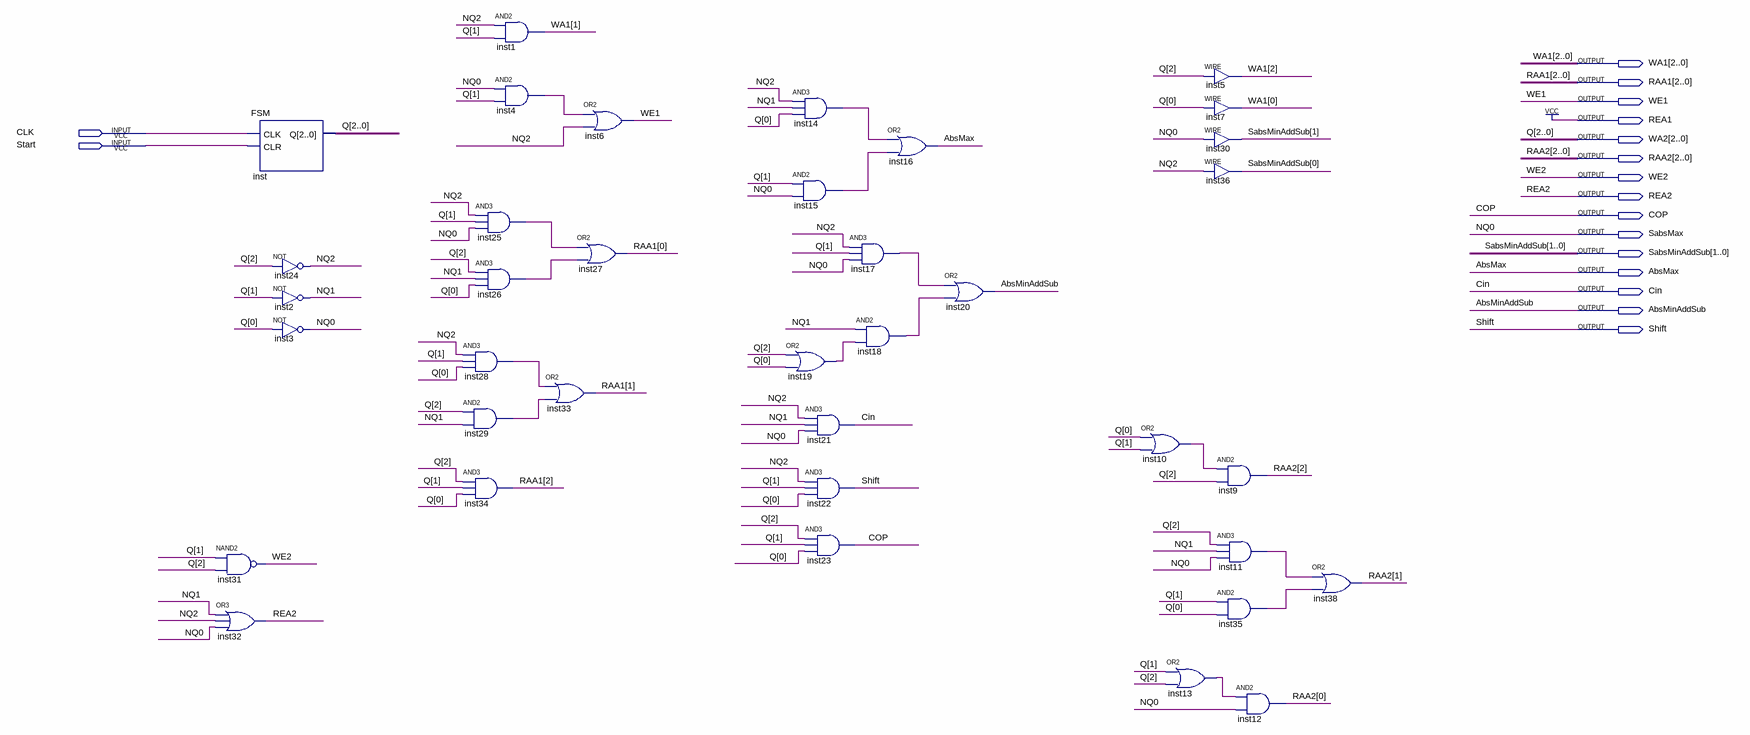
[diagram p0: schematic sheet]
// Quartus schematic Control.bdf as structural Verilog: 37 symbols, 17 pins
module Control (
  input  CLK,
  input  Start,
  output [2:0] WA1,
  output [2:0] RAA1,
  output WE1,
  output REA1,
  output [2:0] WA2,
  output [2:0] RAA2,
  output WE2,
  output REA2,
  output COP,
  output SabsMax,
  output [1:0] SabsMinAddSub,
  output AbsMax,
  output Cin,
  output AbsMinAddSub,
  output Shift
);

  wire inst4_out, inst10_out, inst11_out, inst13_out, inst14_out, inst15_out, inst17_out, inst18_out,
       inst19_out, inst25_out, inst26_out, inst28_out, inst29_out, inst35_out, NQ1, NQ2;

  FSM inst (.CLK(CLK), .CLR(Start), .Q(WA2));
  nand inst31 (WE2, WA2[1], WA2[2]);
  or inst32 (REA2, NQ1, NQ2, SabsMax);
  not inst24 (NQ2, WA2[2]);
  not inst2 (NQ1, WA2[1]);
  not inst3 (SabsMax, WA2[0]);
  and inst28 (inst28_out, NQ2, WA2[1], WA2[0]);
  and inst29 (inst29_out, WA2[2], NQ1);
  and inst34 (RAA1[2], WA2[2], WA2[1], WA2[0]);
  and inst1 (WA1[1], NQ2, WA2[1]);
  and inst4 (inst4_out, SabsMax, WA2[1]);
  and inst25 (inst25_out, NQ2, WA2[1], SabsMax);
  and inst26 (inst26_out, WA2[2], NQ1, WA2[0]);
  or inst33 (RAA1[1], inst28_out, inst29_out);
  or inst6 (WE1, inst4_out, NQ2);
  or inst27 (RAA1[0], inst25_out, inst26_out);
  and inst14 (inst14_out, NQ2, NQ1, WA2[0]);
  and inst15 (inst15_out, WA2[1], SabsMax);
  or inst19 (inst19_out, WA2[2], WA2[0]);
  and inst21 (Cin, NQ2, NQ1, SabsMax);
  and inst22 (Shift, NQ2, WA2[1], WA2[0]);
  and inst23 (COP, WA2[2], WA2[1], WA2[0]);
  and inst17 (inst17_out, NQ2, WA2[1], SabsMax);
  and inst18 (inst18_out, NQ1, inst19_out);
  or inst16 (AbsMax, inst14_out, inst15_out);
  or inst20 (AbsMinAddSub, inst17_out, inst18_out);
  or inst10 (inst10_out, WA2[0], WA2[1]);
  or inst13 (inst13_out, WA2[1], WA2[2]);
  assign WA1[2] = WA2[2];  // WIRE inst5
  assign WA1[0] = WA2[0];  // WIRE inst7
  assign SabsMinAddSub[1] = SabsMax;  // WIRE inst30
  assign SabsMinAddSub[0] = NQ2;  // WIRE inst36
  and inst9 (RAA2[2], inst10_out, WA2[2]);
  and inst11 (inst11_out, WA2[2], NQ1, SabsMax);
  and inst35 (inst35_out, WA2[1], WA2[0]);
  and inst12 (RAA2[0], inst13_out, SabsMax);
  or inst38 (RAA2[1], inst11_out, inst35_out);

  assign REA1 = 1'b1;

  // Other names for the same wires on the sheet: NQ0 = SabsMax; Q[2:0] = WA2
endmodule
